# Altium project STM32F407VGT6.PrjPcb (part 1 of 2)
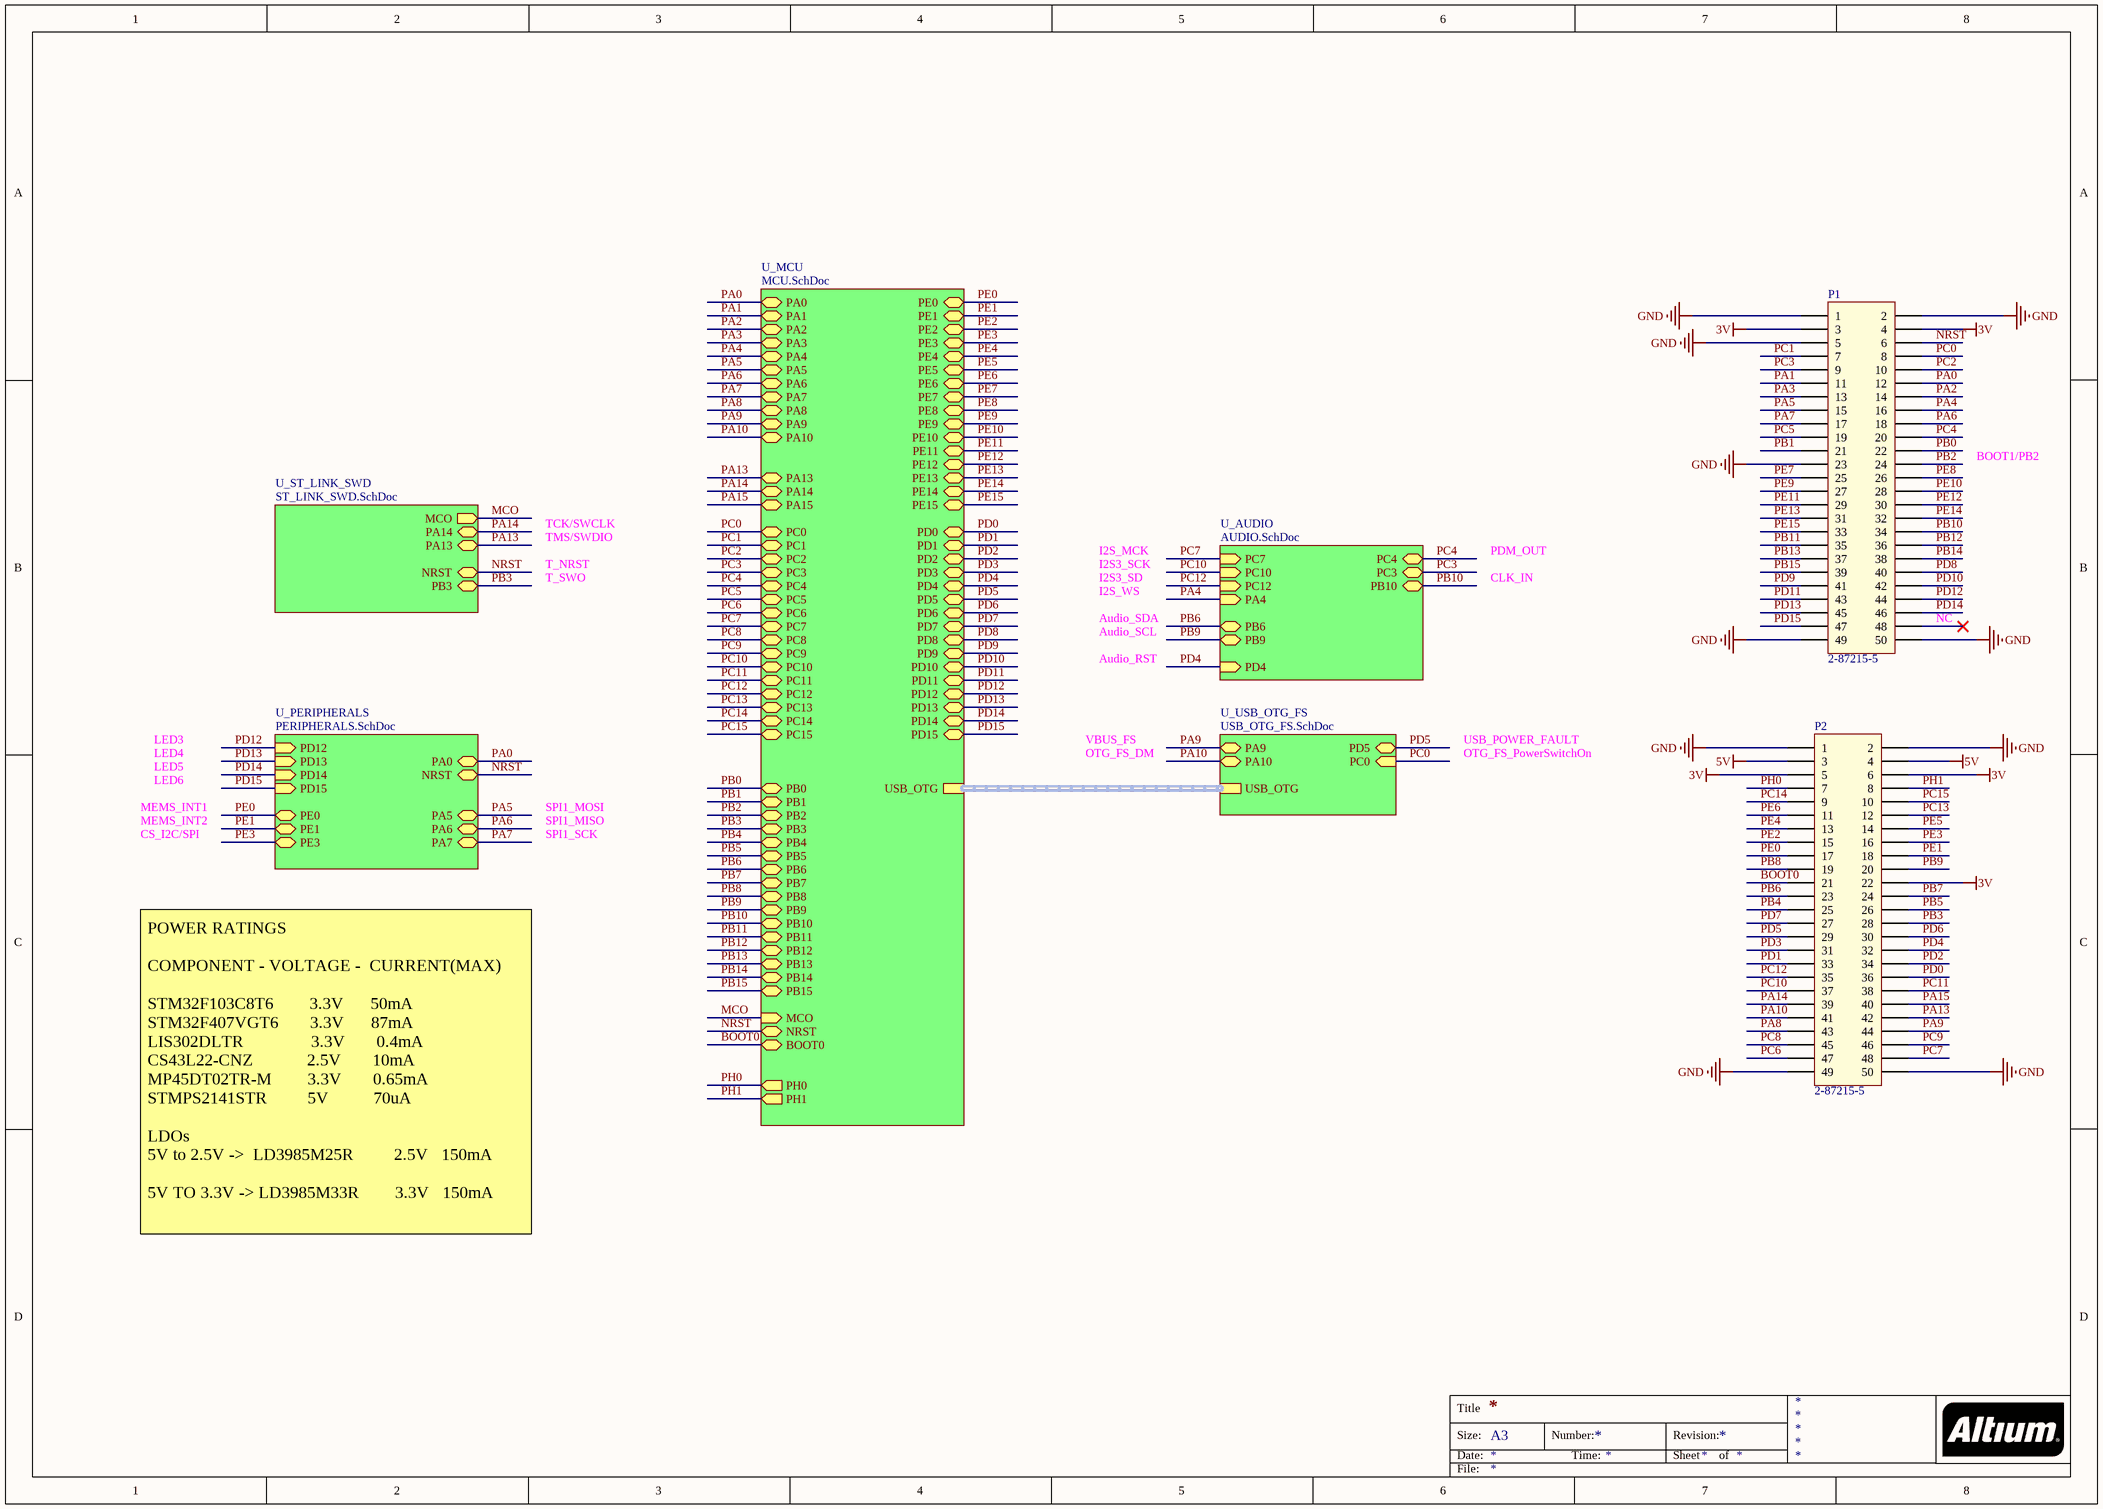
[diagram p0: Main.SchDoc]
6 sheets, 181 parts. Net scope: hierarchical (ports join the sheet entries above them; power ports are global).
Board file: STM32F407VGT6.PcbDoc
Sheets:
  Main.SchDoc
    U_AUDIO = AUDIO.SchDoc
    U_ST_LINK_SWD = ST_LINK_SWD.SchDoc
    U_USB_OTG_FS = USB_OTG_FS.SchDoc
    U_MCU = MCU.SchDoc
    U_PERIPHERALS = PERIPHERALS.SchDoc

## Sheet Main.SchDoc
size A3

### Parts
P1  2-87215-5  [HEADER 25x2]
P2  2-87215-5  [HEADER 25x2]

### Sub-sheets
U_AUDIO = AUDIO.SchDoc: PC4 (bidir), PC3 (bidir), PB10 (bidir), PB9 (bidir), PB6 (bidir), PC7 (in), PC10 (in), PC12 (in), PA4 (in), PD4 (in)
U_MCU = MCU.SchDoc: PA0 (bidir), PA1 (bidir), PA2 (bidir), PA3 (bidir), PA4 (bidir), PA5 (bidir), PA6 (bidir), PA7 (bidir), PA8 (bidir), PA9 (bidir), PA10 (bidir), PA13 (bidir), PA14 (bidir), PA15 (bidir), PE0 (bidir), PE1 (bidir), PE2 (bidir), PE3 (bidir), PE4 (bidir), PE5 (bidir), PE6 (bidir), PE7 (bidir), PE8 (bidir), PE9 (bidir), PE10 (bidir), PE11 (bidir), PE12 (bidir), PE13 (bidir), PE14 (bidir), PE15 (bidir), PC15 (bidir), PC14 (bidir), PC0 (bidir), PC1 (bidir), PC2 (bidir), PC3 (bidir), PC4 (bidir), PC5 (bidir), PC6 (bidir), PC7 (bidir), PC8 (bidir), PC9 (bidir), PC10 (bidir), PC11 (bidir), PC12 (bidir), PC13 (bidir), PB0 (bidir), PB1 (bidir), PB2 (bidir), PB3 (bidir), PB4 (bidir), PB5 (bidir), PB6 (bidir), PB7 (bidir), PB8 (bidir), PB9 (bidir), PB10 (bidir), PB11 (bidir), PB12 (bidir), PB13 (bidir), PB14 (bidir), PB15 (bidir), MCO (in), NRST (bidir), BOOT0 (bidir), PH0 (out), PH1 (out), PD0 (bidir), PD1 (bidir), PD2 (bidir), PD3 (bidir), PD4 (bidir), PD5 (bidir), PD6 (bidir), PD7 (bidir), PD8 (bidir), PD9 (bidir), PD10 (bidir), PD11 (bidir), PD12 (bidir), PD13 (bidir), PD14 (bidir), PD15 (bidir), USB_OTG (harness USB_OTG)
U_PERIPHERALS = PERIPHERALS.SchDoc: NRST (bidir), PD12 (in), PD13 (in), PD14 (in), PD15 (in), PA7 (bidir), PA5 (bidir), PE0 (bidir), PE1 (bidir), PE3 (bidir), PA6 (bidir), PA0 (bidir)
U_ST_LINK_SWD = ST_LINK_SWD.SchDoc: MCO (out), PA14 (bidir), PA13 (bidir), NRST (bidir), PB3 (bidir)
U_USB_OTG_FS = USB_OTG_FS.SchDoc: PA9 (bidir), PA10 (bidir), PC0 (in), PD5 (bidir), USB_OTG (harness USB_OTG)

### Nets
3V: P1.3 P1.4 P2.5 P2.6 P2.22
5V: P2.3 P2.4
GND: P1.1 P1.2 P1.5 P1.23 P1.49 P1.50 P2.1 P2.2 P2.49 P2.50
BOOT0: P2.21 ; sheet U_MCU/BOOT0
MCO: sheet U_ST_LINK_SWD/MCO, sheet U_MCU/MCO
NRST: P1.6 ; sheet U_ST_LINK_SWD/NRST, sheet U_MCU/NRST, sheet U_PERIPHERALS/NRST
PA0: P1.12 ; sheet U_MCU/PA0, sheet U_PERIPHERALS/PA0
PA1: P1.11 ; sheet U_MCU/PA1
PA2: P1.14 ; sheet U_MCU/PA2
PA3: P1.13 ; sheet U_MCU/PA3
PA4: P1.16 ; sheet U_AUDIO/PA4, sheet U_MCU/PA4
PA5: P1.15 ; sheet U_MCU/PA5, sheet U_PERIPHERALS/PA5
PA6: P1.18 ; sheet U_MCU/PA6, sheet U_PERIPHERALS/PA6
PA7: P1.17 ; sheet U_MCU/PA7, sheet U_PERIPHERALS/PA7
PA8: P2.43 ; sheet U_MCU/PA8
PA9: P2.44 ; sheet U_USB_OTG_FS/PA9, sheet U_MCU/PA9
PA10: P2.41 ; sheet U_USB_OTG_FS/PA10, sheet U_MCU/PA10
PA13: P2.42 ; sheet U_ST_LINK_SWD/PA13, sheet U_MCU/PA13
PA14: P2.39 ; sheet U_ST_LINK_SWD/PA14, sheet U_MCU/PA14
PA15: P2.40 ; sheet U_MCU/PA15
PB0: P1.22 ; sheet U_MCU/PB0
PB1: P1.21 ; sheet U_MCU/PB1
PB2: P1.24 ; sheet U_MCU/PB2
PB3: P2.28 ; sheet U_ST_LINK_SWD/PB3, sheet U_MCU/PB3
PB4: P2.25 ; sheet U_MCU/PB4
PB5: P2.26 ; sheet U_MCU/PB5
PB6: P2.23 ; sheet U_AUDIO/PB6, sheet U_MCU/PB6
PB7: P2.24 ; sheet U_MCU/PB7
PB8: P2.19 ; sheet U_MCU/PB8
PB9: P2.20 ; sheet U_AUDIO/PB9, sheet U_MCU/PB9
PB10: P1.34 ; sheet U_AUDIO/PB10, sheet U_MCU/PB10
PB11: P1.35 ; sheet U_MCU/PB11
PB12: P1.36 ; sheet U_MCU/PB12
PB13: P1.37 ; sheet U_MCU/PB13
PB14: P1.38 ; sheet U_MCU/PB14
PB15: P1.39 ; sheet U_MCU/PB15
PC0: P1.8 ; sheet U_USB_OTG_FS/PC0, sheet U_MCU/PC0
PC1: P1.7 ; sheet U_MCU/PC1
PC2: P1.10 ; sheet U_MCU/PC2
PC3: P1.9 ; sheet U_AUDIO/PC3, sheet U_MCU/PC3
PC4: P1.20 ; sheet U_AUDIO/PC4, sheet U_MCU/PC4
PC5: P1.19 ; sheet U_MCU/PC5
PC6: P2.47 ; sheet U_MCU/PC6
PC7: P2.48 ; sheet U_AUDIO/PC7, sheet U_MCU/PC7
PC8: P2.45 ; sheet U_MCU/PC8
PC9: P2.46 ; sheet U_MCU/PC9
PC10: P2.37 ; sheet U_AUDIO/PC10, sheet U_MCU/PC10
PC11: P2.38 ; sheet U_MCU/PC11
PC12: P2.35 ; sheet U_AUDIO/PC12, sheet U_MCU/PC12
PC13: P2.12 ; sheet U_MCU/PC13
PC14: P2.9 ; sheet U_MCU/PC14
PC15: P2.10 ; sheet U_MCU/PC15
PD0: P2.36 ; sheet U_MCU/PD0
PD1: P2.33 ; sheet U_MCU/PD1
PD2: P2.34 ; sheet U_MCU/PD2
PD3: P2.31 ; sheet U_MCU/PD3
PD4: P2.32 ; sheet U_AUDIO/PD4, sheet U_MCU/PD4
PD5: P2.29 ; sheet U_USB_OTG_FS/PD5, sheet U_MCU/PD5
PD6: P2.30 ; sheet U_MCU/PD6
PD7: P2.27 ; sheet U_MCU/PD7
PD8: P1.40 ; sheet U_MCU/PD8
PD9: P1.41 ; sheet U_MCU/PD9
PD10: P1.42 ; sheet U_MCU/PD10
PD11: P1.43 ; sheet U_MCU/PD11
PD12: P1.44 ; sheet U_MCU/PD12, sheet U_PERIPHERALS/PD12
PD13: P1.45 ; sheet U_MCU/PD13, sheet U_PERIPHERALS/PD13
PD14: P1.46 ; sheet U_MCU/PD14, sheet U_PERIPHERALS/PD14
PD15: P1.47 ; sheet U_MCU/PD15, sheet U_PERIPHERALS/PD15
PE0: P2.17 ; sheet U_MCU/PE0, sheet U_PERIPHERALS/PE0
PE1: P2.18 ; sheet U_MCU/PE1, sheet U_PERIPHERALS/PE1
PE2: P2.15 ; sheet U_MCU/PE2
PE3: P2.16 ; sheet U_MCU/PE3, sheet U_PERIPHERALS/PE3
PE4: P2.13 ; sheet U_MCU/PE4
PE5: P2.14 ; sheet U_MCU/PE5
PE6: P2.11 ; sheet U_MCU/PE6
PE7: P1.25 ; sheet U_MCU/PE7
PE8: P1.26 ; sheet U_MCU/PE8
PE9: P1.27 ; sheet U_MCU/PE9
PE10: P1.28 ; sheet U_MCU/PE10
PE11: P1.29 ; sheet U_MCU/PE11
PE12: P1.30 ; sheet U_MCU/PE12
PE13: P1.31 ; sheet U_MCU/PE13
PE14: P1.32 ; sheet U_MCU/PE14
PE15: P1.33 ; sheet U_MCU/PE15
PH0: P2.7 ; sheet U_MCU/PH0
PH1: P2.8 ; sheet U_MCU/PH1

Not connected (* = marked no-connect by the designer): P1 48*

### Buses and harness runs
harness sheet U_MCU/USB_OTG = sheet U_USB_OTG_FS/USB_OTG

### Notes on the sheet
- BOOT1/PB2
- TCK/SWCLK
- TMS/SWDIO
- T_NRST
- T_SWO
- I2S_MCK
- I2S3_SCK
- I2S3_SD
- PDM_OUT
- CLK_IN
- Audio_SDA
- Audio_SCL
- I2S_WS
- (near P1) NC
- Audio_RST
- LED3
- LED4
- LED5
- LED6
- VBUS_FS
- OTG_FS_DM
- OTG_FS_PowerSwitchOn
- USB_POWER_FAULT
- MEMS_INT1
- MEMS_INT2
- CS_I2C/SPI
- SPI1_MOSI
- SPI1_SCK
- SPI1_MISO
- POWER RATINGS
  COMPONENT - VOLTAGE -  CURRENT(MAX)
  STM32F103C8T6        3.3V      50mA
  STM32F407VGT6       3.3V      87mA
  LIS302DLTR               3.3V       0.4mA
  CS43L22-CNZ            2.5V       10mA
  MP45DT02TR-M        3.3V       0.65mA
  STMPS2141STR         5V          70uA
  LDOs
  5V to 2.5V ->  LD3985M25R         2.5V   150mA
  5V TO 3.3V -> LD3985M33R        3.3V   150mA
- Title
- Size:
- Date:
- A3
- Number:
- Time:
- Revision:
- Sheet
- of
- File:

### Library data of the parts
P1 P2 = 2-87215-5: Manufacturer: TE Connectivity (Tyco Electronics); Catalog Drawings: Dual Square Straight Posts / Dual Straight Posts Side; Featured Product: AMPMODU Connectors; 3D Model: 2-87215-5.pdf; Connector Type: Header, Unshrouded; Number of Positions: 50; Number of Positions Loaded: All; Pitch: 0.100" (2.54mm); Dynamic Catalog: AMPMODU Mod II Series; Mating Products: 2-147424-5-ND / - CONN RCPT 50POS VERT .100 T/H / 2-147104-5-ND / - CONN RCPT 50POS DUAL VERT SMD / 2-146762-6-ND / - CONN RCPT 50POS DL VERT .100 T/H / A32951-ND / - CONN RECEPT 50POS .100 VERT DUAL / 2-147095-5-ND / - CONN RECEPT ASMBLY DBL ROW 50POS / A26470-ND / - CONN RECEPT 50POS .100 VERT DUAL / 2-535542-5-ND / - CONN RECEPT 50POS .100 VERT DUAL / 2-86177-1-ND / - CONN RCPT HSNG 50POS DL CRIMP / A25825-ND / - CONN HOUSING 50POS .100 DUAL ROW / A3045-ND / - CONN HOUSING 50POS .100 DUAL; Other Names: 2-87215-5-ND / A26586; Supplier 1: Digikey; Manufacturer Part Number: 2-87215-5; Stock 1: 100; Pricing 1: 1=16.61, 10=15.422, 25=13.84, 50=13.4448, 100=11.863, 250=11.0721, 500=10.8349, 1000=10.2813 (USD); RoHS Information: 2-87215-5 Statement of Compliance; Standard Package: 100; Category: Connectors, Interconnects; Family: Rectangular Connectors - Headers, Male Pins; Series: AMPMODU Mod II; Contact Type: Male Pin; Number of Rows: 2; Row Spacing: 0.100" (2.54mm); Contact Mating Length: 0.318" (8.08mm); Mounting Type: Through Hole; Termination: Solder; Contact Finish: Gold; Contact Finish Thickness: 30µin (0.76µm); Color: Black; Packaging: Bulk; ComponentLink1URL: https://datasheet.ciiva.com/9478/eng-cs-1307819-section-5-0908-9478390.pdf; ComponentLink1Description: https://datasheet.ciiva.com/9478/eng-cs-1307819-section-5-0908-9478390.pdf; ComponentLink2URL: https://datasheet.ciiva.com/713/eng-cd-87215-j4-713258.pdf; ComponentLink2Description: https://datasheet.ciiva.com/713/eng-cd-87215-j4-713258.pdf

## Sheet AUDIO.SchDoc
size A4
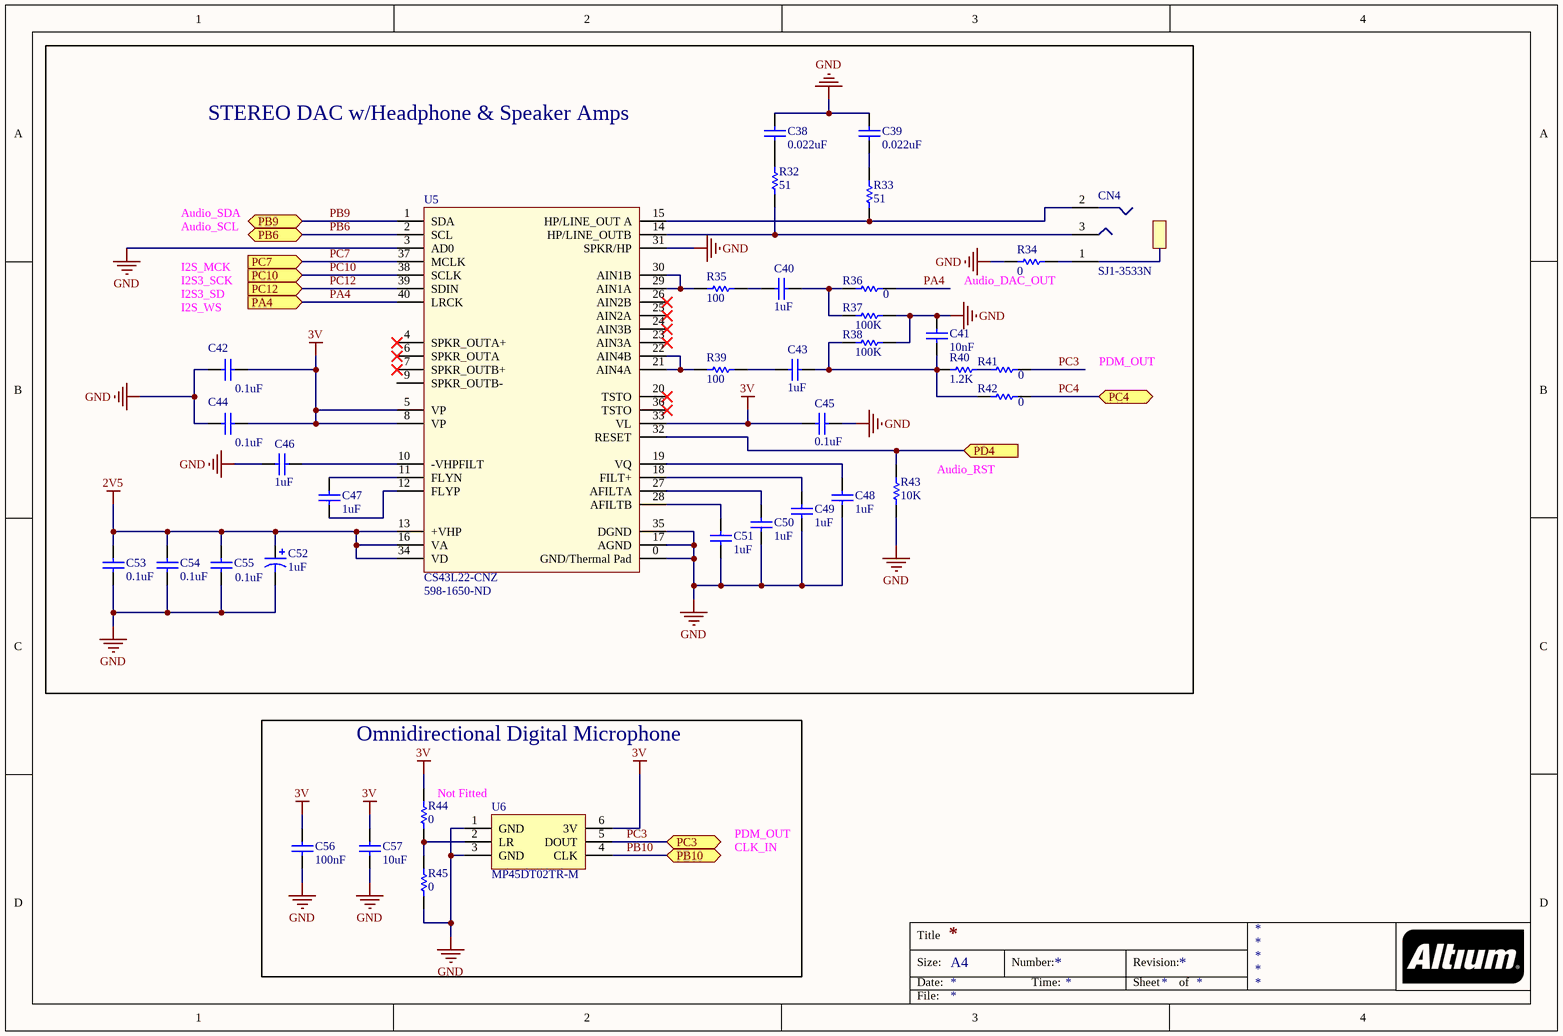
[diagram p1: AUDIO.SchDoc]

### Parts
C38  value 0.022uF  [CAPC0402B]  (hidden comment: Cap)
C39  value 0.022uF  [CAPC0402B]  (hidden comment: Cap)
C40  value 1uF  [CAPC0603B]  (hidden comment: Cap)
C41  value 10nF  [CAPC0402B]  (hidden comment: Cap)
C42  value 0.1uF  [CAPC0402B]  (hidden comment: Cap)
C43  value 1uF  [CAPC0603B]  (hidden comment: Cap)
C44  value 0.1uF  [CAPC0402B]  (hidden comment: Cap)
C45  value 0.1uF  [CAPC0402B]  (hidden comment: Cap)
C46  value 1uF  [CAPC0603B]  (hidden comment: Cap)
C47  value 1uF  [CAPC0603B]  (hidden comment: Cap)
C48  value 1uF  [CAPC0603B]  (hidden comment: Cap)
C49  value 1uF  [CAPC0603B]  (hidden comment: Cap)
C50  value 1uF  [CAPC0603B]  (hidden comment: Cap)
C51  value 1uF  [CAPC0603B]  (hidden comment: Cap)
C52  value 1uF  [TANTALUM CASE A_LEVEL B]  (hidden comment: Cap Pol1)
C53  value 0.1uF  [CAPC0402B]  (hidden comment: Cap)
C54  value 0.1uF  [CAPC0402B]  (hidden comment: Cap)
C55  value 0.1uF  [CAPC0402B]  (hidden comment: Cap)
C56  value 100nF  [CAPC0603B]  (hidden comment: Cap)
C57  value 10uF  [CAPC0402B]  (hidden comment: Cap)
CN4  SJ1-3533N  [SJ1-3533N]
R32  value 51  [RESC0402B]  (hidden comment: Res1)
R33  value 51  [RESC0402B]  (hidden comment: Res1)
R34  value 0  [RESC0603B]  (hidden comment: Res1)
R35  value 100  [RESC0402B]  (hidden comment: Res1)
R36  value 0  [RESC0603B]  (hidden comment: Res1)
R37  value 100K  [RESC0402B]  (hidden comment: Res1)
R38  value 100K  [RESC0402B]  (hidden comment: Res1)
R39  value 100  [RESC0402B]  (hidden comment: Res1)
R40  value 1.2K  [RESC0402B]  (hidden comment: Res1)
R41  value 0  [RESC0603B]  (hidden comment: Res1)
R42  value 0  [RESC0603B]  (hidden comment: Res1)
R43  value 10K  [RESC0603B]  (hidden comment: Res1)
R44  value 0  [RESC0603B]  (hidden comment: Res1)
R45  value 0  [RESC0603B]  (hidden comment: Res1)
U5  CS43L22-CNZ  Supplier Part Number 1: 598-1650-ND  [40QFN]
U6  MP45DT02TR-M  [MP45DT02TR]

### Blocks framed on the sheet
STEREO DAC w/Headphone & Speaker Amps: C38-C55 CN4 R32-R43 U5
Omnidirectional Digital Microphone: C56 C57 R44 R45 U6

### Ports
PA4 (in), PB6 (bidir), PB9 (bidir), PB10 (bidir), PC3 (bidir), PC4 (bidir), PC7 (in), PC10 (in), PC12 (in), PD4 (in)

### Nets
2V5: C52.1 C53.2 C54.2 C55.2 U5.13(+VHP) U5.16(VA) U5.34(VD)
3V: C42.2 C44.2 C45.2 C56.2 C57.2 R44.2 U5.5(VP) U5.8(VP) U5.33(VL) U6.6(3V)
GND: C38.2 C39.2 C41.2 C42.1 C44.1 C45.1 C46.1 C48.2 C49.2 C50.2 C51.1 C52.2 C53.1 C54.1 C55.1 C56.1 C57.1 R34.1 R37.2 R38.2 R43.1 R45.1 U5.0(GND/Thermal_Pad) U5.3(AD0) U5.17(AGND) U5.31(SPKR/HP) U5.35(DGND) U6.1(GND) U6.3(GND)
PA4: R36.2 U5.40(LRCK) ; port PA4
PB6: U5.2(SCL) ; port PB6
PB9: U5.1(SDA) ; port PB9
PB10: U6.4(CLK) ; port PB10
PC3: R41.2 U6.5(DOUT) ; port PC3
PC4: R42.2 ; port PC4
PC7: U5.37(MCLK) ; port PC7
PC10: U5.38(SCLK) ; port PC10
PC12: U5.39(SDIN) ; port PC12
PD4: R43.2 U5.32(RESET) ; port PD4
NetC38_1: C38.1 R32.2
NetC39_1: C39.1 R33.2
NetC40_1: C40.1 R35.1
NetC40_2: C40.2 R36.1 R37.1
NetC41_1: C41.1 C43.2 R38.1 R40.1 R42.1
NetC43_1: C43.1 R39.1
NetC46_2: C46.2 U5.10(-VHPFILT)
NetC47_1: C47.1 U5.12(FLYP)
NetC47_2: C47.2 U5.11(FLYN)
NetC48_1: C48.1 U5.19(VQ)
NetC49_1: C49.1 U5.18(FILT+)
NetC50_1: C50.1 U5.27(AFILTA)
NetC51_2: C51.2 U5.28(AFILTB)
NetCN4_1: CN4.1 R34.2
NetCN4_2: CN4.2 R33.1 U5.15(HP/LINE_OUT_A)
NetCN4_3: CN4.3 R32.1 U5.14(HP/LINE_OUTB)
NetR35_2: R35.2 U5.29(AIN1A) U5.30(AIN1B)
NetR39_2: R39.2 U5.21(AIN4A) U5.22(AIN4B)
NetR40_2: R40.2 R41.1
NetR44_1: R44.1 R45.2 U6.2(LR)

Not connected (* = marked no-connect by the designer): U5 4(SPKR_OUTA+)* 6(SPKR_OUTA)* 7(SPKR_OUTB+)* 9(SPKR_OUTB-) 20(TSTO)* 23(AIN3A)* 24(AIN3B)* 25(AIN2A)* 26(AIN2B)* 36(TSTO)*

### Notes on the sheet
- Audio_SDA
- Audio_SCL
- I2S_MCK
- I2S3_SCK
- I2S3_SD
- I2S_WS
- (near R34) Audio_DAC_OUT
- PDM_OUT
- (near R43) Audio_RST
- (near R44) Not Fitted
- CLK_IN
- Title
- Size:
- Date:
- A4
- Number:
- Time:
- Revision:
- Sheet
- of
- File:

### Library data of the parts
C38 C39 = Cap_8: Capacitor; Published: 8-Jun-2000; LatestRevisionDate: 17-Jul-2002; LatestRevisionNote: Re-released for DXP Platform.; PackageReference: RAD-0.3; Publisher: Altium Limited; PackageDescription: Radial Cap, Thru-Hole; 2 Leads; 0.3 in Pin Spacing
C40 C43 C46-C51 = Cap_4: Capacitor; Published: 8-Jun-2000; LatestRevisionDate: 17-Jul-2002; LatestRevisionNote: Re-released for DXP Platform.; PackageReference: RAD-0.3; Publisher: Altium Limited; PackageDescription: Radial Cap, Thru-Hole; 2 Leads; 0.3 in Pin Spacing
C41 = Cap_7: Capacitor; Published: 8-Jun-2000; LatestRevisionDate: 17-Jul-2002; LatestRevisionNote: Re-released for DXP Platform.; PackageReference: RAD-0.3; Publisher: Altium Limited; PackageDescription: Radial Cap, Thru-Hole; 2 Leads; 0.3 in Pin Spacing
C42 C44 C45 C53-C55 = Cap_6: Capacitor; Published: 8-Jun-2000; LatestRevisionDate: 17-Jul-2002; LatestRevisionNote: Re-released for DXP Platform.; PackageReference: RAD-0.3; Publisher: Altium Limited; PackageDescription: Radial Cap, Thru-Hole; 2 Leads; 0.3 in Pin Spacing
C52 = Cap Pol1: Polarized Capacitor (Radial); Published: 8-Jun-2000; LatestRevisionDate: 17-Jul-2002; LatestRevisionNote: Re-released for DXP Platform.; PackageReference: RB7.6-15; Publisher: Altium Limited; PackageDescription: Polarized Capacitor (Radial); 2 Leads
C56 = Cap_3: Capacitor; Published: 8-Jun-2000; LatestRevisionDate: 17-Jul-2002; LatestRevisionNote: Re-released for DXP Platform.; PackageReference: RAD-0.3; Publisher: Altium Limited; PackageDescription: Radial Cap, Thru-Hole; 2 Leads; 0.3 in Pin Spacing
C57 = Cap_5: Capacitor; Published: 8-Jun-2000; LatestRevisionDate: 17-Jul-2002; LatestRevisionNote: Re-released for DXP Platform.; PackageReference: RAD-0.3; Publisher: Altium Limited; PackageDescription: Radial Cap, Thru-Hole; 2 Leads; 0.3 in Pin Spacing
CN4 = PHONE JACK 3.5mm: 3.50mm (0.141", 1/8", Mini Plug) - Headphone Phone Jack Stereo Connector Solder; Manufacturer: CUI; Gender: Female; Actual Diameter: 0.142" (3.60mm); Number of Positions/Contacts: 3 Conductors, 3 Contacts; Internal Switch(s): Does Not Contain Switch; Shielding: Unshielded; Voltage - Rated: 12VDC; Current Rating: 1A; Mating Length/Depth: 0.551" (14.00mm); Body Material: Brass; Body Color: Silver, Black; Includes: 1 pc - 1 Connector; Supplier 1: Digikey; Manufacturer Part Number: SJ1-3533N; Stock 1: 8782; Pricing 1: 1=1.22, 10=1.076, 25=1.0128, 50=0.9706, 100=0.9284, 250=0.844, 500=0.7596, 1000=0.6752, 2500=0.6119 (USD); Category: Connectors, Interconnects; Family: Barrel - Audio Connectors; Series: SJ1; Packaging: Bulk; Connector Type: Phone Jack; Signal Lines: Stereo; Industry Recognized Mating Diameter: 3.50mm (0.141", 1/8", Mini Plug) - Headphone; Mounting Type: Through Hole, Right Angle; Termination: Solder; Features: -; Insulation Color: -; Contact Material - Plating: Tin; ComponentLink1URL: https://datasheet.ciiva.com/16381/sj1-353xn-series-16381818.pdf; ComponentLink1Description: https://datasheet.ciiva.com/16381/sj1-353xn-series-16381818.pdf
R32 R33 = Res1_8: Resistor; Published: 8-Jun-2000; LatestRevisionDate: 17-Jul-2002; LatestRevisionNote: Re-released for DXP Platform.; PackageReference: AXIAL-0.3; Publisher: Altium Limited; PackageDescription: Axial Device, Thru-Hole; 2 Leads; 0.3 in Pin Spacing
R34 R36 R41 R42 R44 R45 = Res1: Resistor; Published: 8-Jun-2000; LatestRevisionDate: 17-Jul-2002; LatestRevisionNote: Re-released for DXP Platform.; PackageReference: AXIAL-0.3; Publisher: Altium Limited; PackageDescription: Axial Device, Thru-Hole; 2 Leads; 0.3 in Pin Spacing
R35 R39 = Res1_4: Resistor; Published: 8-Jun-2000; LatestRevisionDate: 17-Jul-2002; LatestRevisionNote: Re-released for DXP Platform.; PackageReference: AXIAL-0.3; Publisher: Altium Limited; PackageDescription: Axial Device, Thru-Hole; 2 Leads; 0.3 in Pin Spacing
R37 R38 = Res1_5: Resistor; Published: 8-Jun-2000; LatestRevisionDate: 17-Jul-2002; LatestRevisionNote: Re-released for DXP Platform.; PackageReference: AXIAL-0.3; Publisher: Altium Limited; PackageDescription: Axial Device, Thru-Hole; 2 Leads; 0.3 in Pin Spacing
R40 = Res1_7: Resistor; Published: 8-Jun-2000; LatestRevisionDate: 17-Jul-2002; LatestRevisionNote: Re-released for DXP Platform.; PackageReference: AXIAL-0.3; Publisher: Altium Limited; PackageDescription: Axial Device, Thru-Hole; 2 Leads; 0.3 in Pin Spacing
R43 = Res1_2: Resistor; Published: 8-Jun-2000; LatestRevisionDate: 17-Jul-2002; LatestRevisionNote: Re-released for DXP Platform.; PackageReference: AXIAL-0.3; Publisher: Altium Limited; PackageDescription: Axial Device, Thru-Hole; 2 Leads; 0.3 in Pin Spacing
U5 = CS43L22-CNZ: Manufacturer: Cirrus Logic; PCN Assembly/Origin: Assembly/Test Supplier Transfer 06/Feb/2014 Assembly/Test Site Transfer Jun/2014 Assembly/Test Site Revision 01/Aug/2014; EDA / CAD Models: Download from Accelerated Designs; Resolution (Bits): 24 b; Sampling Rate (Per Second): 96k; Data Interface: I²S; Voltage Supply Source: Analog and Digital; Voltage - Supply: 1.65 V ~ 2.63 V; Online Catalog: Audio, Video; For Use With: 598-1529-ND                                                          - BOARD EVAL FOR CS43L22; Other Names: 598-1650  CS43L22CNZ; Supplier 1: Digikey; Manufacturer Part Number: CS43L22-CNZ; Stock 1: 3643; Pricing 1: 1=5.96, 10=5.325, 25=4.7924, 100=4.3665, 250=3.9405, 500=3.5358, 1000=2.982, 2500=2.8329 (USD); Standard Package: 50; Category: Integrated Circuits (ICs); Family: Data Acquisition - ADCs/DACs - Special Purpose; Series: -; Packaging: Tray; Type: DAC, Audio; Operating Temperature: -40°C ~ 85°C; Mounting Type: Surface Mount; Package / Case: 40-VFQFN Exposed Pad; Supplier Device Package: 40-QFN (6x6); ComponentLink1URL: https://datasheet.ciiva.com/1494/91818-1494314.pdf; ComponentLink1Description: https://datasheet.ciiva.com/1494/91818-1494314.pdf; ComponentLink2URL: https://datasheet.ciiva.com/6665/cs43l22-f2-6665692.pdf; ComponentLink2Description: https://datasheet.ciiva.com/6665/cs43l22-f2-6665692.pdf; ComponentLink3URL: https://datasheet.ciiva.com/3040/cs43l22-f2-3040429.pdf; ComponentLink3Description: https://datasheet.ciiva.com/3040/cs43l22-f2-3040429.pdf; ComponentLink4URL: https://datasheet.ciiva.com/16606/cs43l22-f2-16606863.pdf; ComponentLink4Description: https://datasheet.ciiva.com/16606/cs43l22-f2-16606863.pdf; ComponentLink5URL: https://datasheet.ciiva.com/26802/cs43l22-cnz-26802243.pdf; ComponentLink5Description: https://datasheet.ciiva.com/26802/cs43l22-cnz-26802243.pdf
U6 = MP45DT02TR

## Sheet ST_LINK_SWD.SchDoc
size A2
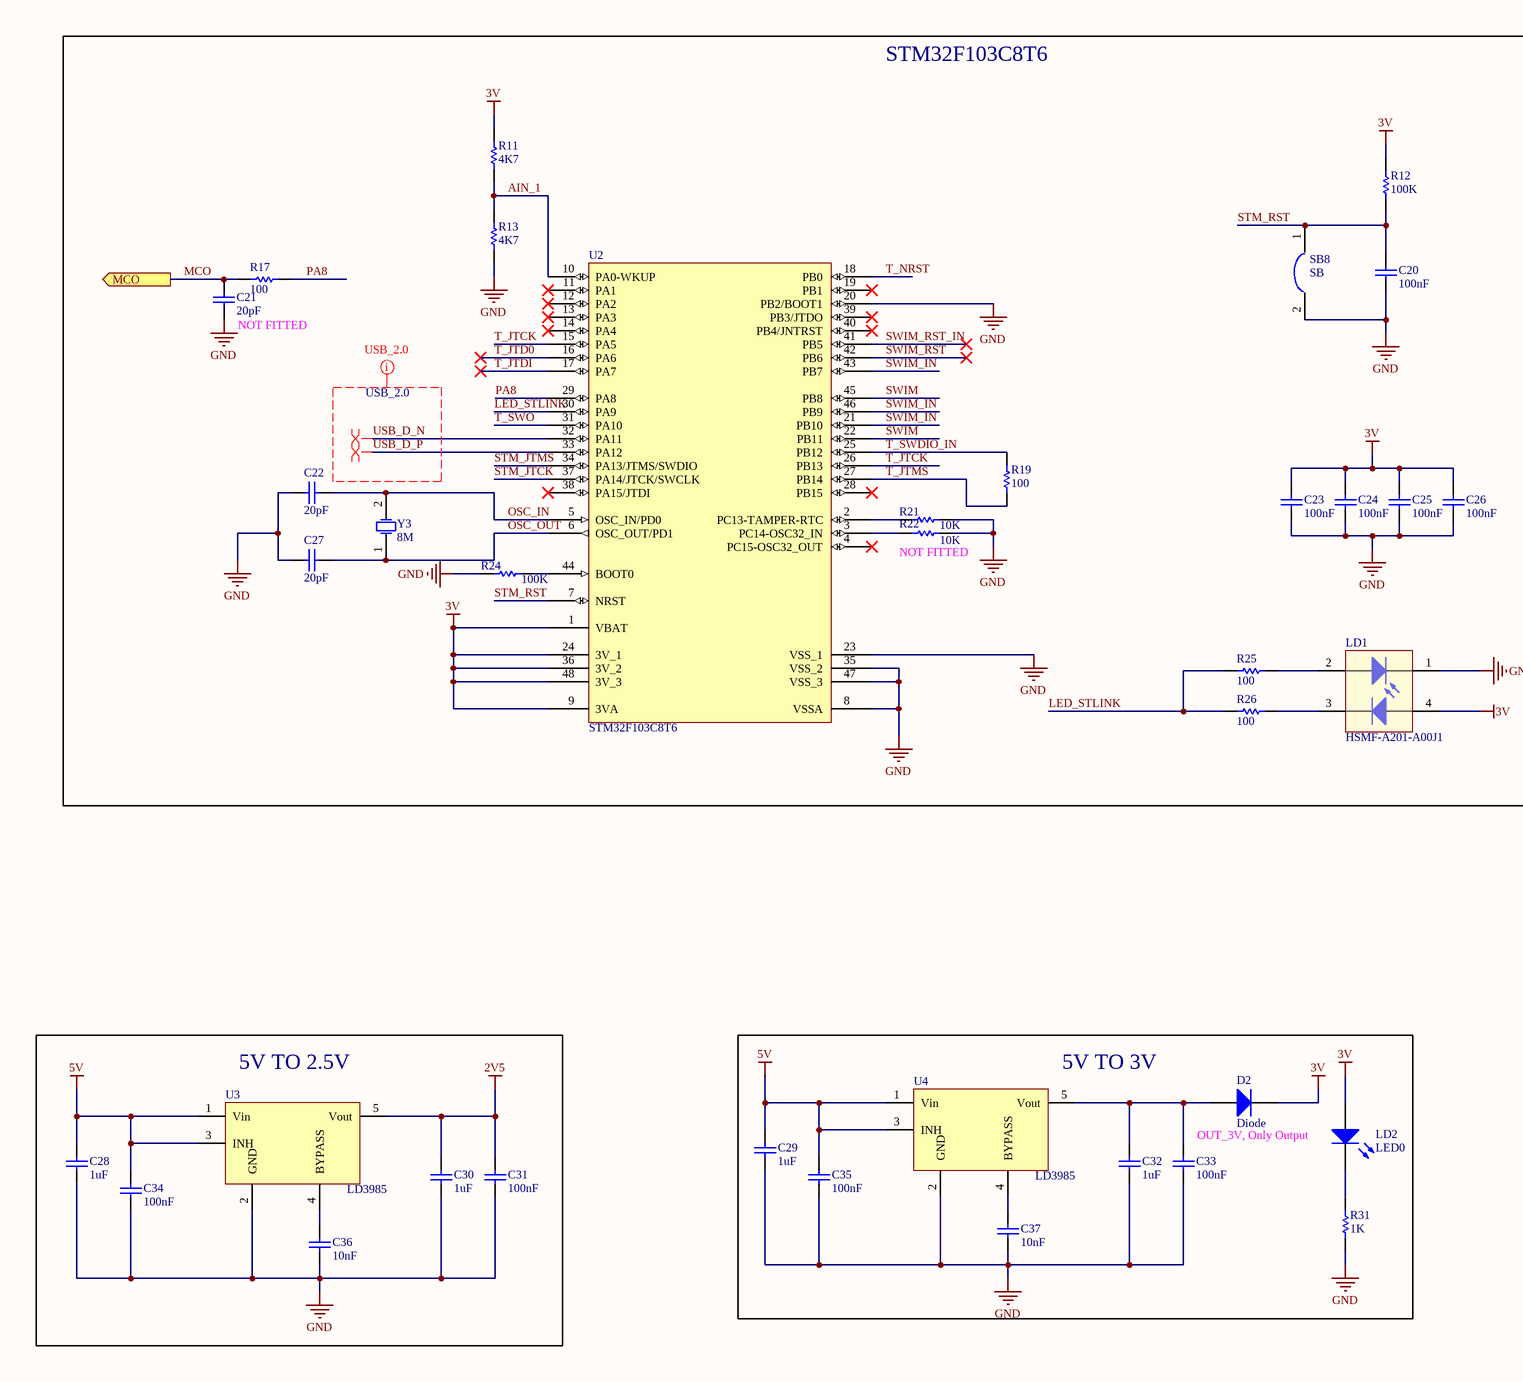
[diagram p2: ST_LINK_SWD.SchDoc, left]
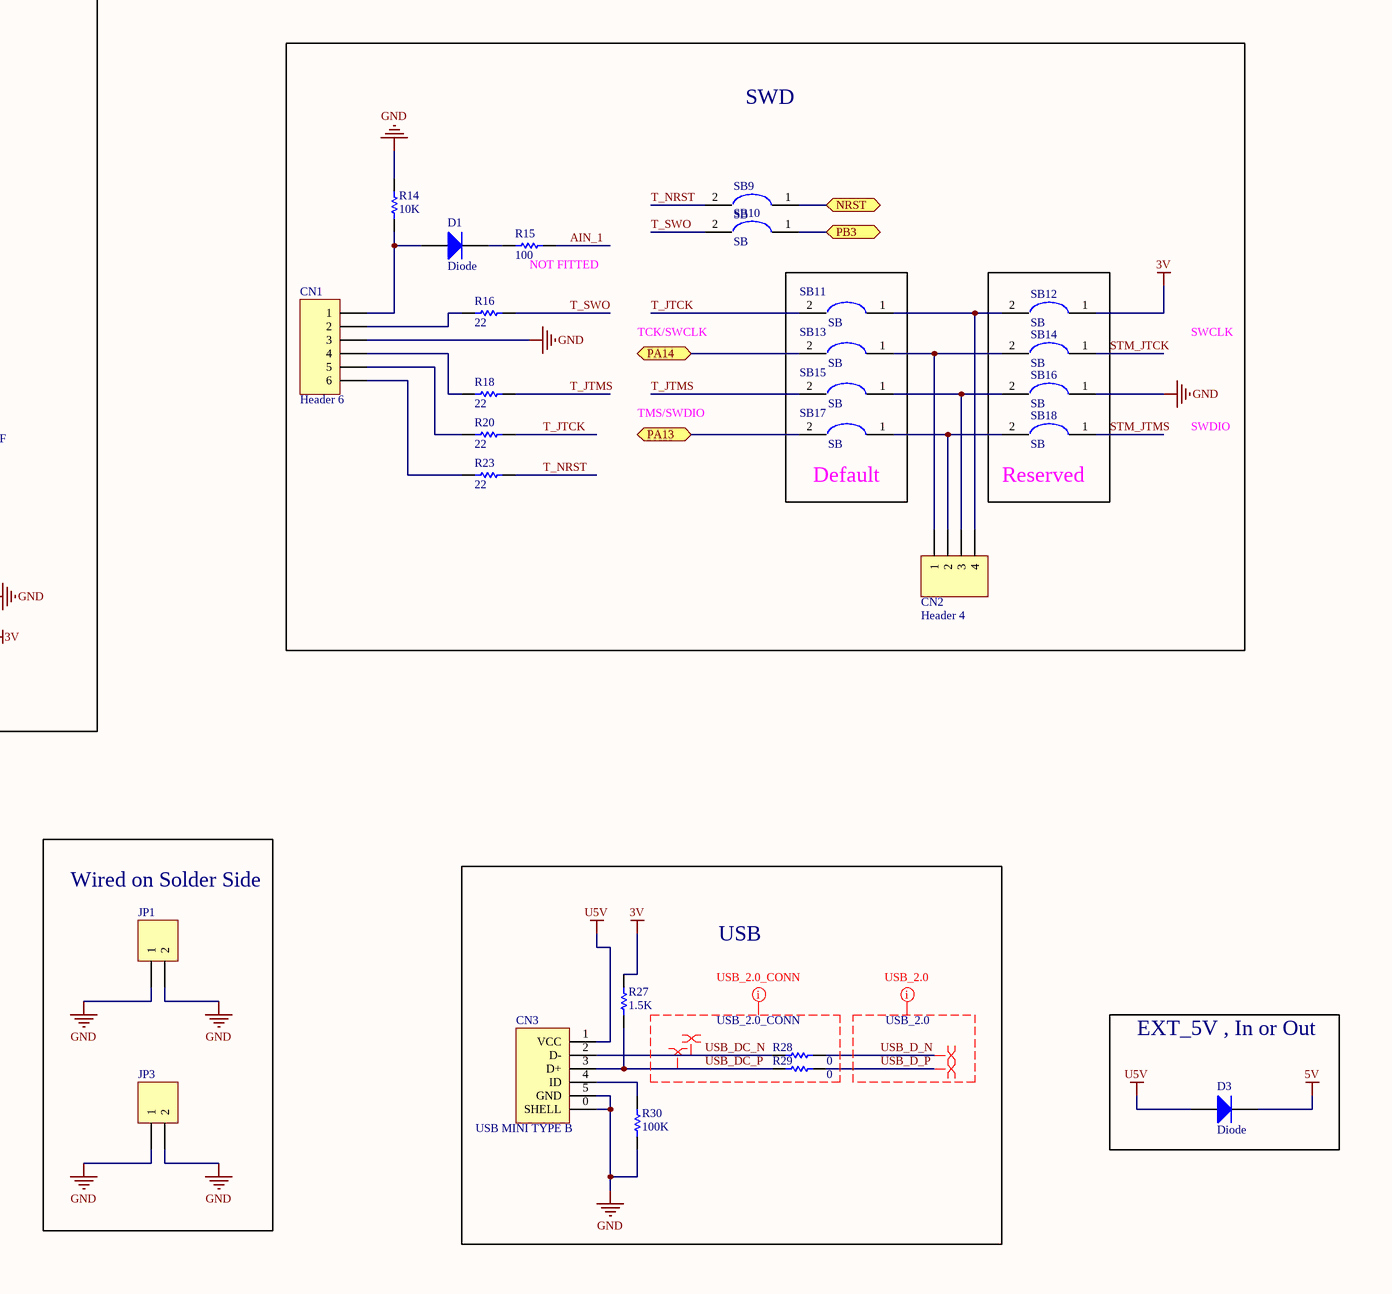
[diagram p3: ST_LINK_SWD.SchDoc, right]

### Parts
C20  value 100nF  [CAPC0603B]  (hidden comment: Cap)
C21  value 20pF  [CAPC0603B]  (hidden comment: Cap)
C22  value 20pF  [CAPC0603B]  (hidden comment: Cap)
C23  value 100nF  [CAPC0603B]  (hidden comment: Cap)
C24  value 100nF  [CAPC0603B]  (hidden comment: Cap)
C25  value 100nF  [CAPC0603B]  (hidden comment: Cap)
C26  value 100nF  [CAPC0603B]  (hidden comment: Cap)
C27  value 20pF  [CAPC0603B]  (hidden comment: Cap)
C28  value 1uF  [CAPC0603B]  (hidden comment: Cap)
C29  value 1uF  [CAPC0603B]  (hidden comment: Cap)
C30  value 1uF  [CAPC0603B]  (hidden comment: Cap)
C31  value 100nF  [CAPC0603B]  (hidden comment: Cap)
C32  value 1uF  [CAPC0603B]  (hidden comment: Cap)
C33  value 100nF  [CAPC0603B]  (hidden comment: Cap)
C34  value 100nF  [CAPC0603B]  (hidden comment: Cap)
C35  value 100nF  [CAPC0603B]  (hidden comment: Cap)
C36  value 10nF  [CAPC0402B]  (hidden comment: Cap)
C37  value 10nF  [CAPC0402B]  (hidden comment: Cap)
CN1  Header 6  [HDR1X6]
CN2  Header 4  [HDR1X4]
CN3  USB MINI TYPE B  [USB_MINI_TYPE_B]
D1  Diode  [SOD-323]
D2  Diode  [SOD-323]
D3  Diode  [SOD-323]
JP1  Header 2  [HDR1X2]  (value not drawn)
JP3  Header 2  [HDR1X2]  (value not drawn)
LD1  HSMF-A201-A00J1  [HSMF-A201-A00J1]
LD2  LED0  [LED_0603]
R11  value 4K7  [RESC0402B]  (hidden comment: Res1)
R12  value 100K  [RESC0402B]  (hidden comment: Res1)
R13  value 4K7  [RESC0402B]  (hidden comment: Res1)
R14  value 10K  [RESC0603B]  (hidden comment: Res1)
R15  value 100  [RESC0402B]  (hidden comment: Res1)
R16  value 22  [RESC0402B]  (hidden comment: Res1)
R17  value 100  [RESC0402B]  (hidden comment: Res1)
R18  value 22  [RESC0402B]  (hidden comment: Res1)
R19  value 100  [RESC0402B]  (hidden comment: Res1)
R20  value 22  [RESC0402B]  (hidden comment: Res1)
R21  value 10K  [RESC0603B]  (hidden comment: Res1)
R22  value 10K  [RESC0603B]  (hidden comment: Res1)
R23  value 22  [RESC0402B]  (hidden comment: Res1)
R24  value 100K  [RESC0402B]  (hidden comment: Res1)
R25  value 100  [RESC0402B]  (hidden comment: Res1)
R26  value 100  [RESC0402B]  (hidden comment: Res1)
R27  value 1.5K  [RESC0402B]  (hidden comment: Res1)
R28  value 0  [RESC0603B]  (hidden comment: Res1)
R29  value 0  [RESC0603B]  (hidden comment: Res1)
R30  value 100K  [RESC0402B]  (hidden comment: Res1)
R31  value 1K  [RESC0402B]  (hidden comment: Res1)
SB8  SB  [SB]
SB9  SB  [SB]
SB10  SB  [SB]
SB11  SB  [SB]
SB12  SB  [SB]
SB13  SB  [SB]
SB14  SB  [SB]
SB15  SB  [SB]
SB16  SB  [SB]
SB17  SB  [SB]
SB18  SB  [SB]
U2  STM32F103C8T6  [LQFP48_N]
U3  LD3985  [TSOT-23-5]
U4  LD3985  [TSOT-23-5]
Y3  8M  [HC-49S]

### Blocks framed on the sheet
STM32F103C8T6: C20-C27 LD1 R11-R13 R17 R19 R21 R22 R24-R26 SB8 U2 Y3
SWD: CN1 CN2 D1 R14-R16 R18 R20 R23 SB9 SB10
Default: SB11 SB13 SB15 SB17
Reserved: SB12 SB14 SB16 SB18
Wired on Solder Side: JP1 JP3
USB: CN3 R27-R30
5V TO 2.5V: C28 C30 C31 C34 C36 U3
5V TO 3V: C29 C32 C33 C35 C37 D2 LD2 R31 U4
EXT_5V , In or Out: D3

### Ports
MCO (out), NRST (bidir), PA13 (bidir), PA14 (bidir), PB3 (bidir)

### Nets
2V5: C30.2 C31.2 U3.5(Vout)
3V: C23.2 C24.2 C25.2 C26.2 D2.2(K) LD1.4 LD2.1(A) R11.2 R12.1 R27.2 SB12.1 U2.1(VBAT) U2.9(3VA) U2.24(3V_1) U2.36(3V_2) U2.48(3V_3)
5V: C28.2 C29.2 C34.2 C35.2 D3.2(K) U3.1(Vin) U3.3(INH) U4.1(Vin) U4.3(INH)
GND: C20.1 C21.1 C22.1 C23.1 C24.1 C25.1 C26.1 C27.1 C28.1 C29.1 C30.1 C31.1 C32.1 C33.1 C34.1 C35.1 C36.1 C37.1 CN1.3 CN3.0(SHELL) CN3.5(GND) JP1.1 JP1.2 JP3.1 JP3.2 LD1.1(A) R13.1 R14.2 R21.2 R22.2 R24.1 R30.2 R31.1 SB8.2 SB16.1 U2.8(VSSA) U2.20(PB2/BOOT1) U2.23(VSS_1) U2.35(VSS_2) U2.47(VSS_3) U3.2(GND) U4.2(GND)
U5V: CN3.1(VCC) D3.1(A)
AIN_1: R11.1 R13.2 R15.1 U2.10(PA0-WKUP)
LED_STLINK: R25.2 R26.2 U2.30(PA9)
MCO: C21.2 R17.2 ; port MCO
NRST: SB9.1 ; port NRST
OSC_IN: C22.2 U2.5(OSC_IN/PD0) Y3.2(OSC2)
OSC_OUT: C27.2 U2.6(OSC_OUT/PD1) Y3.1(OSC1)
PA8: R17.1 U2.29(PA8)
PA13: SB17.2 ; port PA13
PA14: SB13.2 ; port PA14
PB3: SB10.1 ; port PB3
STM_JTCK: SB14.1 U2.37(PA14/JTCK/SWCLK)
STM_JTMS: SB18.1 U2.34(PA13/JTMS/SWDIO)
STM_RST: C20.2 R12.2 SB8.1 U2.7(NRST)
SWIM: U2.22(PB11) U2.45(PB8)
SWIM_IN: U2.21(PB10) U2.43(PB7) U2.46(PB9)
SWIM_RST: U2.42(PB6)
SWIM_RST_IN: U2.41(PB5)
T_JTCK: R20.2 SB11.2 U2.15(PA5) U2.26(PB13)
T_JTD0: U2.16(PA6)
T_JTDI: U2.17(PA7)
T_JTMS: R18.2 R19.1 SB15.2 U2.27(PB14)
T_NRST: R23.2 SB9.2 U2.18(PB0)
T_SWDIO_IN: R19.2 U2.25(PB12)
T_SWO: R16.2 SB10.2 U2.31(PA10)
USB_D_N: R28.2 U2.32(PA11)
USB_D_P: R29.2 U2.33(PA12)
USB_DC_N: CN3.2(D-) R28.1
USB_DC_P: CN3.3(D+) R27.1 R29.1
NetC32_2: C32.2 C33.2 D2.1(A) U4.5(Vout)
NetC36_2: C36.2 U3.4(BYPASS)
NetC37_2: C37.2 U4.4(BYPASS)
NetCN1_1: CN1.1 D1.1(A) R14.1
NetCN1_2: CN1.2 R16.1
NetCN1_4: CN1.4 R18.1
NetCN1_5: CN1.5 R20.1
NetCN1_6: CN1.6 R23.1
NetCN2_1: CN2.1 SB13.1 SB14.2
NetCN2_2: CN2.2 SB17.1 SB18.2
NetCN2_3: CN2.3 SB15.1 SB16.2
NetCN2_4: CN2.4 SB11.1 SB12.2
NetCN3_4: CN3.4(ID) R30.1
NetD1_2: D1.2(K) R15.2
NetLD1_2: LD1.2(K) R25.1
NetLD1_3: LD1.3 R26.1
NetLD2_2: LD2.2(K) R31.2
NetR21_1: R21.1 U2.2(PC13-TAMPER-RTC)
NetR22_1: R22.1 U2.3(PC14-OSC32_IN)
NetR24_2: R24.2 U2.44(BOOT0)

Not connected (* = marked no-connect by the designer): U2 4(PC15-OSC32_OUT)* 11(PA1)* 12(PA2)* 13(PA3)* 14(PA4)* 19(PB1)* 28(PB15)* 38(PA15/JTDI)* 39(PB3/JTDO)* 40(PB4/JNTRST)*

### Layout directives
differential pair: USB_D_N, USB_D_P, USB_DC_N, USB_DC_P
net class USB_2.0: USB_D_N, USB_D_P
net class USB_2.0_CONN: USB_DC_N, USB_DC_P

### Notes on the sheet
- (near C21) NOT FITTED
- (near R15) NOT FITTED
- TCK/SWCLK
- SWCLK
- TMS/SWDIO
- SWDIO
- (near R22) NOT FITTED
- OUT_3V, Only Output
- Title
- Size:
- Date:
- File:
- A2
- Number:
- Time:
- Revision:
- Sheet
- of

### Library data of the parts
C20 C23-C26 C31 C33-C35 = Cap_3: Capacitor; Published: 8-Jun-2000; LatestRevisionDate: 17-Jul-2002; LatestRevisionNote: Re-released for DXP Platform.; PackageReference: RAD-0.3; Publisher: Altium Limited; PackageDescription: Radial Cap, Thru-Hole; 2 Leads; 0.3 in Pin Spacing
C21 C22 C27 = Cap: Capacitor; Published: 8-Jun-2000; LatestRevisionDate: 17-Jul-2002; LatestRevisionNote: Re-released for DXP Platform.; PackageReference: RAD-0.3; Publisher: Altium Limited; PackageDescription: Radial Cap, Thru-Hole; 2 Leads; 0.3 in Pin Spacing
C28-C30 C32 = Cap_4: Capacitor; Published: 8-Jun-2000; LatestRevisionDate: 17-Jul-2002; LatestRevisionNote: Re-released for DXP Platform.; PackageReference: RAD-0.3; Publisher: Altium Limited; PackageDescription: Radial Cap, Thru-Hole; 2 Leads; 0.3 in Pin Spacing
C36 C37 = Cap_7: Capacitor; Published: 8-Jun-2000; LatestRevisionDate: 17-Jul-2002; LatestRevisionNote: Re-released for DXP Platform.; PackageReference: RAD-0.3; Publisher: Altium Limited; PackageDescription: Radial Cap, Thru-Hole; 2 Leads; 0.3 in Pin Spacing
CN1 = Header 6: Header, 6-Pin; LatestRevisionDate: 17-Jul-2002; LatestRevisionNote: Re-released for DXP Platform.; Publisher: Altium Limited
CN2 = Header 4: Header, 4-Pin; LatestRevisionDate: 17-Jul-2002; LatestRevisionNote: Re-released for DXP Platform.; Publisher: Altium Limited
D1-D3 = Diode: Default Diode; Published: 8-Jun-2000; LatestRevisionDate: 17-Jul-2002; LatestRevisionNote: Re-released for DXP Platform.; PackageVersion: Sep-1996; PackageReference: SMC; Publisher: Altium Limited; PackageDescription: DO-214-AB/SMC; 2 C-Bend Leads; Body 7.9 x 5.9 mm, inc. leads (LxW); Code_JEDEC: DO-214-AB
JP1 JP3 = Header 2: Header, 2-Pin; LatestRevisionDate: 17-Jul-2002; LatestRevisionNote: Re-released for DXP Platform.; Publisher: Altium Limited
LD1 = HSMF-A201-A00J1: Manufacturer: Broadcom / Avago Technologies; Chip Material: GaP; DELETED: Compliant; Emitting Color: Red/Yellow Green; Forward Voltage: 2.6 V; Forward Current: 30/20 mA; Dominant Wave Length: 626/569 nm; Lum Intensity: 16/20mcd; High Brightness: No; Number of  Elements: 2; Main Category: Chip LED; Power Dissipation: 78/48 W; Peak Wavelength: 635/565 nm; Shape Type: Circular; Type: Bi-Color; Reverse Voltage: 5 V; Viewing Angle: 120 deg; Test Current (It): 20 mA; Product Depth (mm): 3.2 mm; Product Height (mm): 1.8 mm; Product Length (mm): 2.8 mm; Supplier 1: Digikey; Manufacturer Part Number: HSMF-A201-A00J1; Stock 1: 460; Pricing 1: 1=0.61, 10=0.472, 25=0.3932, 100=0.3388, 250=0.3025, 500=0.2602, 1000=0.2009 (USD); Mounting: Surface Mount; Operating Temp Range: -55C to 100C; Lens Dimensions: 2.2x2.2x0.8 mm; Luminous Intensity: 16/20mcd; Package Type: PLCC; Packaging: Tape and Reel; Pin Count: 4; Operating Temperature Classification: Industrial; Rad Hardened: No; ComponentLink1URL: https://datasheet.ciiva.com/29280/180547-da-01-en-plcc-4-led-hsmf-a201-a00j1-gelb-gruen-29280722.pdf; ComponentLink1Description: https://datasheet.ciiva.com/29280/180547-da-01-en-plcc-4-led-hsmf-a201-a00j1-gelb-gruen-29280722.pdf; ComponentLink2URL: https://datasheet.ciiva.com/11775/0900766b804ebe6b-11775846.pdf; ComponentLink2Description: https://datasheet.ciiva.com/11775/0900766b804ebe6b-11775846.pdf; ComponentLink3URL: https://datasheet.ciiva.com/4688/v02-0501en+ds+hsmx-a2xx+02feb2012-107193-4688327.pdf; ComponentLink3Description: https://datasheet.ciiva.com/4688/v02-0501en+ds+hsmx-a2xx+02feb2012-107193-4688327.pdf; ComponentLink4URL: https://datasheet.ciiva.com/15117/getdatasheetpartid-135296-15117690.pdf; ComponentLink4Description: https://datasheet.ciiva.com/15117/getdatasheetpartid-135296-15117690.pdf
LD2 = LED0: Typical INFRARED GaAs LED; Published: 8-Jun-2000; LatestRevisionDate: 08-Jul-2005; LatestRevisionNote: Mech Layer 1 removed.; PackageReference: LED-0; Publisher: Altium Limited; PackageDescription: LED; 2 Leads
R11 R13 = Res1_16: Resistor; Published: 8-Jun-2000; LatestRevisionDate: 17-Jul-2002; LatestRevisionNote: Re-released for DXP Platform.; PackageReference: AXIAL-0.3; Publisher: Altium Limited; PackageDescription: Axial Device, Thru-Hole; 2 Leads; 0.3 in Pin Spacing
R12 R24 R30 = Res1_5: Resistor; Published: 8-Jun-2000; LatestRevisionDate: 17-Jul-2002; LatestRevisionNote: Re-released for DXP Platform.; PackageReference: AXIAL-0.3; Publisher: Altium Limited; PackageDescription: Axial Device, Thru-Hole; 2 Leads; 0.3 in Pin Spacing
R14 R21 R22 = Res1_2: Resistor; Published: 8-Jun-2000; LatestRevisionDate: 17-Jul-2002; LatestRevisionNote: Re-released for DXP Platform.; PackageReference: AXIAL-0.3; Publisher: Altium Limited; PackageDescription: Axial Device, Thru-Hole; 2 Leads; 0.3 in Pin Spacing
R15 R17 R19 R25 R26 = Res1_4: Resistor; Published: 8-Jun-2000; LatestRevisionDate: 17-Jul-2002; LatestRevisionNote: Re-released for DXP Platform.; PackageReference: AXIAL-0.3; Publisher: Altium Limited; PackageDescription: Axial Device, Thru-Hole; 2 Leads; 0.3 in Pin Spacing
R16 R18 R20 R23 = Res1_11: Resistor; Published: 8-Jun-2000; LatestRevisionDate: 17-Jul-2002; LatestRevisionNote: Re-released for DXP Platform.; PackageReference: AXIAL-0.3; Publisher: Altium Limited; PackageDescription: Axial Device, Thru-Hole; 2 Leads; 0.3 in Pin Spacing
R27 = Res1_15: Resistor; Published: 8-Jun-2000; LatestRevisionDate: 17-Jul-2002; LatestRevisionNote: Re-released for DXP Platform.; PackageReference: AXIAL-0.3; Publisher: Altium Limited; PackageDescription: Axial Device, Thru-Hole; 2 Leads; 0.3 in Pin Spacing
R28 R29 = Res1: Resistor; Published: 8-Jun-2000; LatestRevisionDate: 17-Jul-2002; LatestRevisionNote: Re-released for DXP Platform.; PackageReference: AXIAL-0.3; Publisher: Altium Limited; PackageDescription: Axial Device, Thru-Hole; 2 Leads; 0.3 in Pin Spacing
R31 = Res1_17: Resistor; Published: 8-Jun-2000; LatestRevisionDate: 17-Jul-2002; LatestRevisionNote: Re-released for DXP Platform.; PackageReference: AXIAL-0.3; Publisher: Altium Limited; PackageDescription: Axial Device, Thru-Hole; 2 Leads; 0.3 in Pin Spacing
U2 = STM32F103C8T6: STM32 ARM-based 32-bit MCU with 64 Kbytes Flash, 48-pin LQFP, Industrial Temperature; Published: 30-May-2008; DatasheetVersion: rev6, Mar-2008; PackageVersion: Mar-2008; PackageReference: LQFP48; Publisher: Altium Limited; PackageDescription: 48-Pin Low-Profile Quad Flat Pack, 7 x 7 mm Body, 0.5 mm Pitch (LQFP48); ComponentLink1Description: Manufacturer Link; ComponentLink1URL: www.st.com/stm32; ComponentLink2Description: Datasheet; ComponentLink2URL: http://www.st.com/stonline/products/literature/ds/13587.pdf
U3 U4 = LD3985: Manufacturer: STMicroelectronics; Manufacturer Part Number: LD3985G33R; Other Related Documents: LD3985XX33 View All Specifications LD3985XX33 View All Specifications; EDA / CAD Models: Download from Accelerated Designs; Regulator Topology: Positive Fixed; Voltage - Output: 3.3V; Current - Output: 150mA; Voltage - Dropout (Typical): 0.06V @ 150mA; Number of Regulators: 1; Voltage - Input: Up to 6V; Current - Limit (Min): 300mA; Other Names: 497-7793-6; Supplier 1: Digikey; Stock 1: 937; Pricing 1: 1=0.65, 10=0.574, 100=0.4404, 500=0.3481 (USD); Standard Package: 1; Category: Integrated Circuits (ICs); Family: PMIC - Voltage Regulators - Linear; Series: -; Packaging: Digi-Reel®; Operating Temperature: -40°C ~ 125°C; Mounting Type: Surface Mount; Package / Case: SOT-23-5 Thin, TSOT-23-5; Supplier Device Package: TSOT-23-5; ComponentLink1URL: https://datasheet.ciiva.com/2053/cd00003395-2053393.pdf; ComponentLink1Description: https://datasheet.ciiva.com/2053/cd00003395-2053393.pdf; ComponentLink2URL: https://datasheet.ciiva.com/2053/cd00003395-2053394.pdf; ComponentLink2Description: https://datasheet.ciiva.com/2053/cd00003395-2053394.pdf; ComponentLink3URL: https://datasheet.ciiva.com/2053/cd00003395-2053395.pdf; ComponentLink3Description: https://datasheet.ciiva.com/2053/cd00003395-2053395.pdf
Y3 = XTAL: Crystal Oscillator; Published: 8-Jun-2000; LatestRevisionDate: 17-Jul-2002; LatestRevisionNote: Re-released for DXP Platform.; PackageReference: R38; Publisher: Altium Limited; PackageDescription: Crystal, Thru-Hole; 2 Leads; Body 3.1 x 8.2 mm (Dia.xH)
CN3 = USB MINI TYPE B: Component Type: Connector

## Sheet USB_OTG_FS.SchDoc
size A4
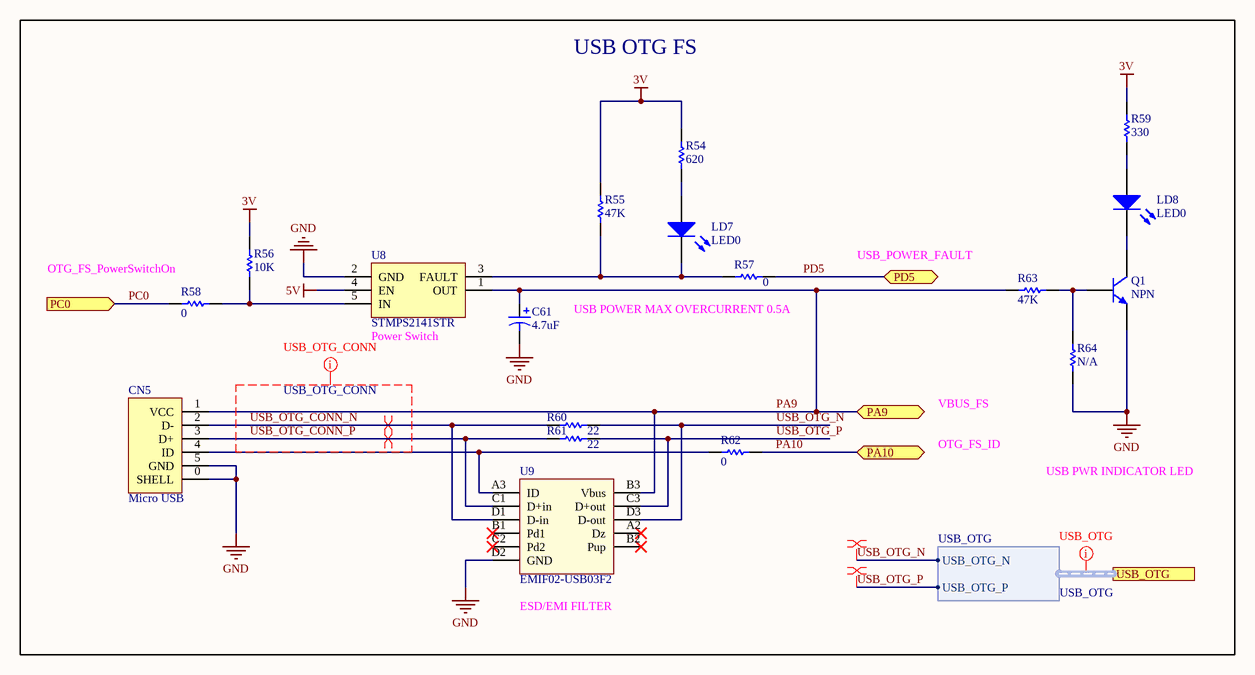
[diagram p4: USB_OTG_FS.SchDoc]

### Parts
C61  value 4.7uF  [TANTALUM CASE A_LEVEL B]  (hidden comment: Cap Pol1)
CN5  Micro USB  [USB MICRO]
LD7  LED0  [LED_0603]
LD8  LED0  [LED_0603]
Q1  NPN  [SOT-23]
R54  value 620  [RESC0402B]  (hidden comment: Res1)
R55  value 47K  [RESC0402B]  (hidden comment: Res1)
R56  value 10K  [RESC0603B]  (hidden comment: Res1)
R57  value 0  [RESC0603B]  (hidden comment: Res1)
R58  value 0  [RESC0603B]  (hidden comment: Res1)
R59  value 330  [RESC0402B]  (hidden comment: Res1)
R60  value 22  [RESC0402B]  (hidden comment: Res1)
R61  value 22  [RESC0402B]  (hidden comment: Res1)
R62  value 0  [RESC0603B]  (hidden comment: Res1)
R63  value 47K  [RESC0402B]  (hidden comment: Res1)
R64  Res1  [RESC0402B]  (value not drawn)
U8  STMPS2141STR  [TSOT-23-5]
U9  EMIF02-USB03F2  [EMIF02-USB03F2]

### Ports
PA9 (bidir), PA10 (bidir), PC0 (in), PD5 (bidir), USB_OTG (harness USB_OTG)

### Harnesses
USB_OTG: USB_OTG_N, USB_OTG_P

### Nets
3V: R54.2 R55.2 R56.2 R59.2
5V: U8.4(EN)
GND: C61.2 CN5.0(SHELL) CN5.5(GND) Q1.3(E) R64.1 U8.2(GND) U9.D2(GND)
PA9: C61.1 CN5.1(VCC) R63.2 U8.1(OUT) U9.B3(Vbus) ; port PA9
PA10: R62.2 ; port PA10
PC0: R58.2 ; port PC0
PD5: R57.2 ; port PD5
USB_OTG_CONN_N: CN5.2(D-) R60.1 U9.D1(D-in)
USB_OTG_CONN_P: CN5.3(D+) R61.1 U9.C1(D+in)
USB_OTG_N: R60.2 U9.D3(D-out) ; port USB_OTG.USB_OTG_N  [project net USB_OTG_MCU_N]
USB_OTG_P: R61.2 U9.C3(D+out) ; port USB_OTG.USB_OTG_P  [project net USB_OTG_MCU_P]
NetCN5_4: CN5.4(ID) R62.1 U9.A3(ID)
NetLD7_1: LD7.1(A) R54.1
NetLD7_2: LD7.2(K) R55.1 R57.1 U8.3(FAULT)
NetLD8_1: LD8.1(A) R59.1
NetLD8_2: LD8.2(K) Q1.1(C)
NetQ1_2: Q1.2(B) R63.1 R64.2
NetR56_1: R56.1 R58.1 U8.5(IN)

Not connected (* = marked no-connect by the designer): U9 A2(Dz)* B1(Pd1)* B2(Pup)* C2(Pd2)*

### Layout directives
differential pair: USB_OTG_CONN_N, USB_OTG_CONN_P, USB_OTG_MCU_N, USB_OTG_MCU_P
net class USB_OTG_CONN: USB_OTG_CONN_N, USB_OTG_CONN_P
net class USB_OTG: (no net found under the mark)

### Notes on the sheet
- USB OTG FS
- (near R58) OTG_FS_PowerSwitchOn
- USB_POWER_FAULT
- (near U8) Power Switch
- (near R57) USB POWER MAX OVERCURRENT 0.5A
- VBUS_FS
- OTG_FS_ID
- USB PWR INDICATOR LED
- (near U9) ESD/EMI FILTER
- Title
- Size:
- Date:
- A4
- Number:
- Time:
- Revision:
- Sheet
- of
- File:

### Library data of the parts
C61 = Cap Pol1_1: Polarized Capacitor (Radial); Published: 8-Jun-2000; LatestRevisionDate: 17-Jul-2002; LatestRevisionNote: Re-released for DXP Platform.; PackageReference: RB7.6-15; Publisher: Altium Limited; PackageDescription: Polarized Capacitor (Radial); 2 Leads
CN5 = USB MICRO
LD7 LD8 = LED0: Typical INFRARED GaAs LED; Published: 8-Jun-2000; LatestRevisionDate: 08-Jul-2005; LatestRevisionNote: Mech Layer 1 removed.; PackageReference: LED-0; Publisher: Altium Limited; PackageDescription: LED; 2 Leads
Q1 = NPN: NPN Bipolar Transistor; Published: 8-Jun-2000; LatestRevisionDate: 17-Jul-2002; LatestRevisionNote: Re-released for DXP Platform.; PackageReference: TO-226-AA; Publisher: Altium Limited; PackageDescription: TO, Flat Index; 3 In-Line, Axial Leads; Body Dia. 4.8mm; Leads 0.55 x 0.51 mm (max); Code_JEDEC: TO-226-AA
R54 = Res1_10: Resistor; Published: 8-Jun-2000; LatestRevisionDate: 17-Jul-2002; LatestRevisionNote: Re-released for DXP Platform.; PackageReference: AXIAL-0.3; Publisher: Altium Limited; PackageDescription: Axial Device, Thru-Hole; 2 Leads; 0.3 in Pin Spacing
R55 R63 = Res1_9: Resistor; Published: 8-Jun-2000; LatestRevisionDate: 17-Jul-2002; LatestRevisionNote: Re-released for DXP Platform.; PackageReference: AXIAL-0.3; Publisher: Altium Limited; PackageDescription: Axial Device, Thru-Hole; 2 Leads; 0.3 in Pin Spacing
R56 = Res1_2: Resistor; Published: 8-Jun-2000; LatestRevisionDate: 17-Jul-2002; LatestRevisionNote: Re-released for DXP Platform.; PackageReference: AXIAL-0.3; Publisher: Altium Limited; PackageDescription: Axial Device, Thru-Hole; 2 Leads; 0.3 in Pin Spacing
R57 R58 R62 = Res1: Resistor; Published: 8-Jun-2000; LatestRevisionDate: 17-Jul-2002; LatestRevisionNote: Re-released for DXP Platform.; PackageReference: AXIAL-0.3; Publisher: Altium Limited; PackageDescription: Axial Device, Thru-Hole; 2 Leads; 0.3 in Pin Spacing
R59 = Res1_12: Resistor; Published: 8-Jun-2000; LatestRevisionDate: 17-Jul-2002; LatestRevisionNote: Re-released for DXP Platform.; PackageReference: AXIAL-0.3; Publisher: Altium Limited; PackageDescription: Axial Device, Thru-Hole; 2 Leads; 0.3 in Pin Spacing
R60 R61 = Res1_11: Resistor; Published: 8-Jun-2000; LatestRevisionDate: 17-Jul-2002; LatestRevisionNote: Re-released for DXP Platform.; PackageReference: AXIAL-0.3; Publisher: Altium Limited; PackageDescription: Axial Device, Thru-Hole; 2 Leads; 0.3 in Pin Spacing
R64 = Res1_13: Resistor; Published: 8-Jun-2000; LatestRevisionDate: 17-Jul-2002; LatestRevisionNote: Re-released for DXP Platform.; PackageReference: AXIAL-0.3; Publisher: Altium Limited; PackageDescription: Axial Device, Thru-Hole; 2 Leads; 0.3 in Pin Spacing; Value: N/A
U8 = STMPS2141STR: Manufacturer: STMicroelectronics; Other Related Documents: STMPS2141 View All Specifications; Switch Type: General Purpose; Number of Outputs: 1; Ratio - Input:Output: 1:1; Output Configuration: High Side; Output Type: N-Channel; Interface: On/Off; Voltage - Load: 2.7 V ~ 5.5 V; Voltage - Supply (Vcc/Vdd): Not Required; Current - Output (Max): 500mA; Rds On (Typ): 90 mOhm; Input Type: Non-Inverting; Fault Protection: Current Limiting (Fixed), Over Temperature, Reverse Current, UVLO; Other Names: 497-6933-2 / STMPS2141STR-ND; Supplier 1: Digikey; Manufacturer Part Number: STMPS2141STR; Stock 1: 9000; Pricing 1: 3000=0.2093, 6000=0.1958, 15000=0.1823, 30000=0.1728 (USD); Standard Package: 3,000; Category: Integrated Circuits (ICs); Family: PMIC - Power Distribution Switches, Load Drivers; Packaging: Tape & Reel (TR); Operating Temperature: -40°C ~ 125°C (TJ); Package / Case: SC-74A, SOT-753; Supplier Device Package: SOT-23-5; Online Catalog: General Purpose; ComponentLink1URL: https://datasheet.ciiva.com/4923/cd00167470-4923447.pdf; ComponentLink1Description: https://datasheet.ciiva.com/4923/cd00167470-4923447.pdf; ComponentLink2URL: https://datasheet.ciiva.com/1962/cd00167470-1962472.pdf; ComponentLink2Description: https://datasheet.ciiva.com/1962/cd00167470-1962472.pdf; ComponentLink3URL: https://datasheet.ciiva.com/1962/cd00167470-1962473.pdf; ComponentLink3Description: https://datasheet.ciiva.com/1962/cd00167470-1962473.pdf; ComponentLink4URL: https://datasheet.ciiva.com/1962/cd00167470-1962474.pdf; ComponentLink4Description: https://datasheet.ciiva.com/1962/cd00167470-1962474.pdf; ComponentLink5URL: https://datasheet.ciiva.com/16491/cd00167470-16491245.pdf; ComponentLink5Description: https://datasheet.ciiva.com/16491/cd00167470-16491245.pdf; ComponentLink6URL: https://datasheet.ciiva.com/15108/getdatasheetpartid-160072-15108990.pdf; ComponentLink6Description: https://datasheet.ciiva.com/15108/getdatasheetpartid-160072-15108990.pdf
U9 = EMIF02-USB03F2: Manufacturer: STMicroelectronics; Other Related Documents: EMIF02-USB03F2 View All Specifications; Number of Channels: 2; Resistance - Channel (Ohms): 33; Values: R = 33 Ohms, C = 20pF; ESD Protection: Yes; Filter Order: 2nd; Online Catalog: IPAD™ Series; Other Names: 497-13521-2 EMIF02USB03F2; Supplier 1: Digikey; Manufacturer Part Number: EMIF02-USB03F2; Stock 1: 5836; Pricing 1: 1=0.68, 10=0.644, 100=0.4574, 500=0.395, 1000=0.3534 (USD); Standard Package: 5,000; Category: Filters; Family: EMI/RFI Filters (LC, RC Networks); Series: EMIF; Packaging: Tape & Reel (TR); Type: Low Pass; Technology: RC (Pi); Center / Cutoff Frequency: -; Attenuation Value: -; Current: -; Applications: USB; Package / Case: 11-WFBGA, FCBGA; Size / Dimension: 0.076" L x 0.057" W (1.94mm x 1.44mm); Height: 0.028" (0.72mm); Operating Temperature: -40°C ~ 85°C; ComponentLink1URL: https://datasheet.ciiva.com/3068/cd00042880-3068450.pdf; ComponentLink1Description: https://datasheet.ciiva.com/3068/cd00042880-3068450.pdf; ComponentLink2URL: https://datasheet.ciiva.com/12394/cd00042880-211729-12394966.pdf; ComponentLink2Description: https://datasheet.ciiva.com/12394/cd00042880-211729-12394966.pdf; ComponentLink3URL: https://datasheet.ciiva.com/16633/cd00042880-16633017.pdf; ComponentLink3Description: https://datasheet.ciiva.com/16633/cd00042880-16633017.pdf